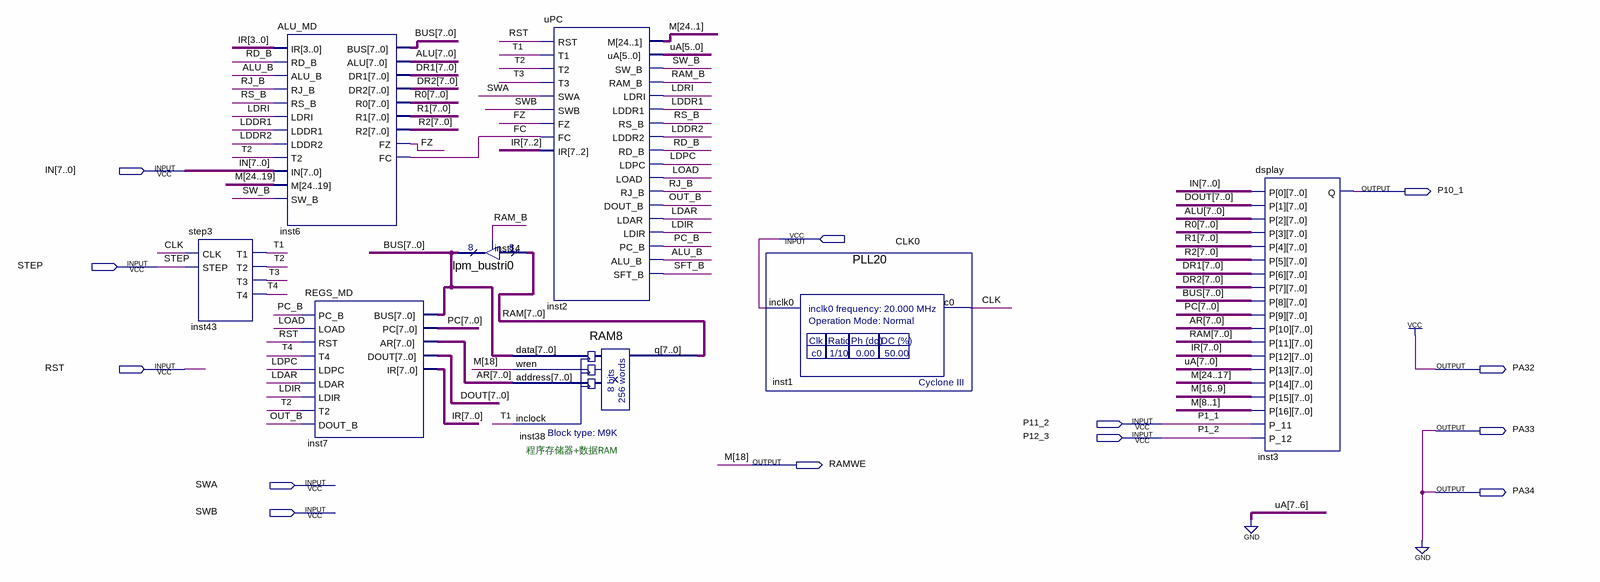
[diagram p0: schematic sheet]
// Quartus schematic CPU5A.bdf as structural Verilog: 8 symbols, 13 pins
module CPU5A (
  input  [7:0] IN,
  input  CLK0,
  input  STEP,
  input  RST,
  input  P11_2,
  input  P12_3,
  input  SWA,
  input  SWB,
  output P10_1,
  output PA32,
  output PA33,
  output RAMWE,
  output PA34
);

  wire ALU_B, CLK, FC, FZ, LDAR, LDDR1, LDDR2, LDIR, LDPC, LDRI, LOAD, OUT_B, PC_B, RAM_B, RD_B, RJ_B, RS_B,
       SFT_B, SW_B, T1, T2, T3, T4;
  wire [5:0] uA;
  wire [7:0] ALU, AR, BUS, DOUT, DR1, DR2, IR, PC, R0, R1, R2, RAM;
  wire [24:1] M;

  step3 inst43 (.CLK(CLK), .STEP(STEP), .T1(T1), .T2(T2), .T3(T3), .T4(T4));
  ALU_MD inst6 (
    .IR(IR[3:0]), .RD_B(RD_B), .ALU_B(ALU_B), .RJ_B(RJ_B), .RS_B(RS_B), .LDRI(LDRI), .LDDR1(LDDR1),
    .LDDR2(LDDR2), .T2(T2), .IN(IN), .M(M[24:19]), .SW_B(SW_B), .BUS(BUS), .ALU(ALU), .DR1(DR1), .DR2(DR2),
    .R0(R0), .R1(R1), .R2(R2), .FZ(FZ), .FC(FC));
  REGS_MD inst7 (
    .PC_B(PC_B), .LOAD(LOAD), .RST(RST), .T4(T4), .LDPC(LDPC), .LDAR(LDAR), .LDIR(LDIR), .T2(T2),
    .DOUT_B(OUT_B), .BUS(BUS), .PC(PC), .AR(AR), .DOUT(DOUT), .IR(IR));
  lpm_bustri0 inst14 (.enabledt(RAM_B), .data(RAM), .tridata(BUS));
  RAM8 inst38 (.data(BUS), .wren(RAMWE), .address(AR), .inclock(T1), .q(RAM));
  uPC inst2 (
    .RST(RST), .T1(T1), .T2(T2), .T3(T3), .SWA(SWA), .SWB(SWB), .FZ(FZ), .FC(FC), .IR(IR[7:2]),
    .M({M[24:19], RAMWE, M[17:1]}), .uA(uA), .SW_B(SW_B), .RAM_B(RAM_B), .LDRI(LDRI), .LDDR1(LDDR1),
    .RS_B(RS_B), .LDDR2(LDDR2), .RD_B(RD_B), .LDPC(LDPC), .LOAD(LOAD), .RJ_B(RJ_B), .DOUT_B(OUT_B),
    .LDAR(LDAR), .LDIR(LDIR), .PC_B(PC_B), .ALU_B(ALU_B), .SFT_B(SFT_B));
  PLL20 inst1 (.inclk0(CLK0), .c0(CLK));
  dsplay inst3 (
    .P_0(IN), .P_1(DOUT), .P_2(ALU), .P_3(R0), .P_4(R1), .P_5(R2), .P_6(DR1), .P_7(DR2), .P_8(BUS), .P_9(PC),
    .P_10(AR), .P_11({RAM, P11_2}), .P_12({IR, P12_3}), .P_13({2'b00, uA}), .P_14({M[24:19], RAMWE, M[17]}),
    .P_15(M[16:9]), .P_16(M[8:1]), .Q(P10_1));

  assign PA32 = 1'b1;
  assign PA33 = 1'b0;
  assign PA34 = 1'b0;

  // Other names for the same wires on the sheet: M[18] = RAMWE; P1_1 = P11_2; P1_2 = P12_3

  // Notes on the sheet:
  //   程序存储器+数据RAM
endmodule
